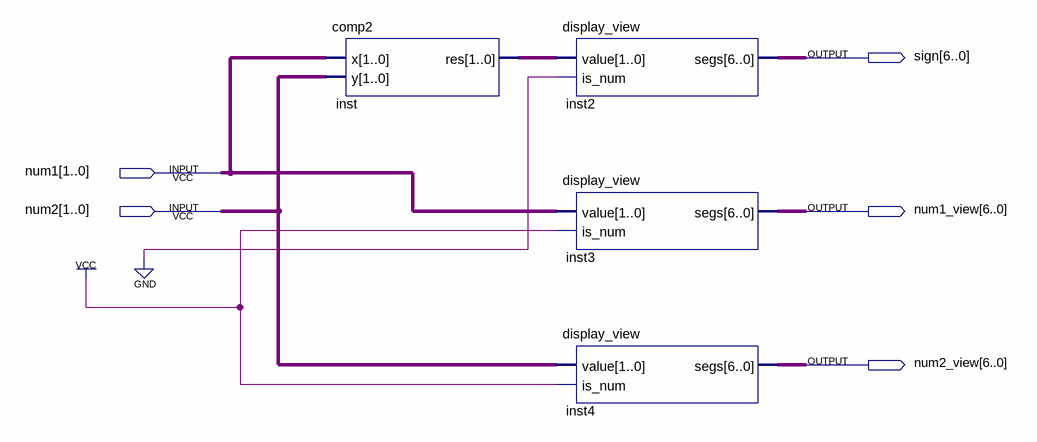
[diagram p0: schematic sheet]
// Quartus schematic main.bdf as structural Verilog: 4 symbols, 5 pins
module main (
  input  [1:0] num1,
  input  [1:0] num2,
  output [6:0] sign,
  output [6:0] num1_view,
  output [6:0] num2_view
);

  wire [1:0] inst_res;

  comp2 inst (.x(num1), .y(num2), .res(inst_res));
  display_view inst2 (.value(inst_res), .is_num(1'b0), .segs(sign));
  display_view inst3 (.value(num1), .is_num(1'b1), .segs(num1_view));
  display_view inst4 (.value(num2), .is_num(1'b1), .segs(num2_view));
endmodule
